# EAGLE design ardunio-physics-board-v2 (EAGLE 9.6.2)
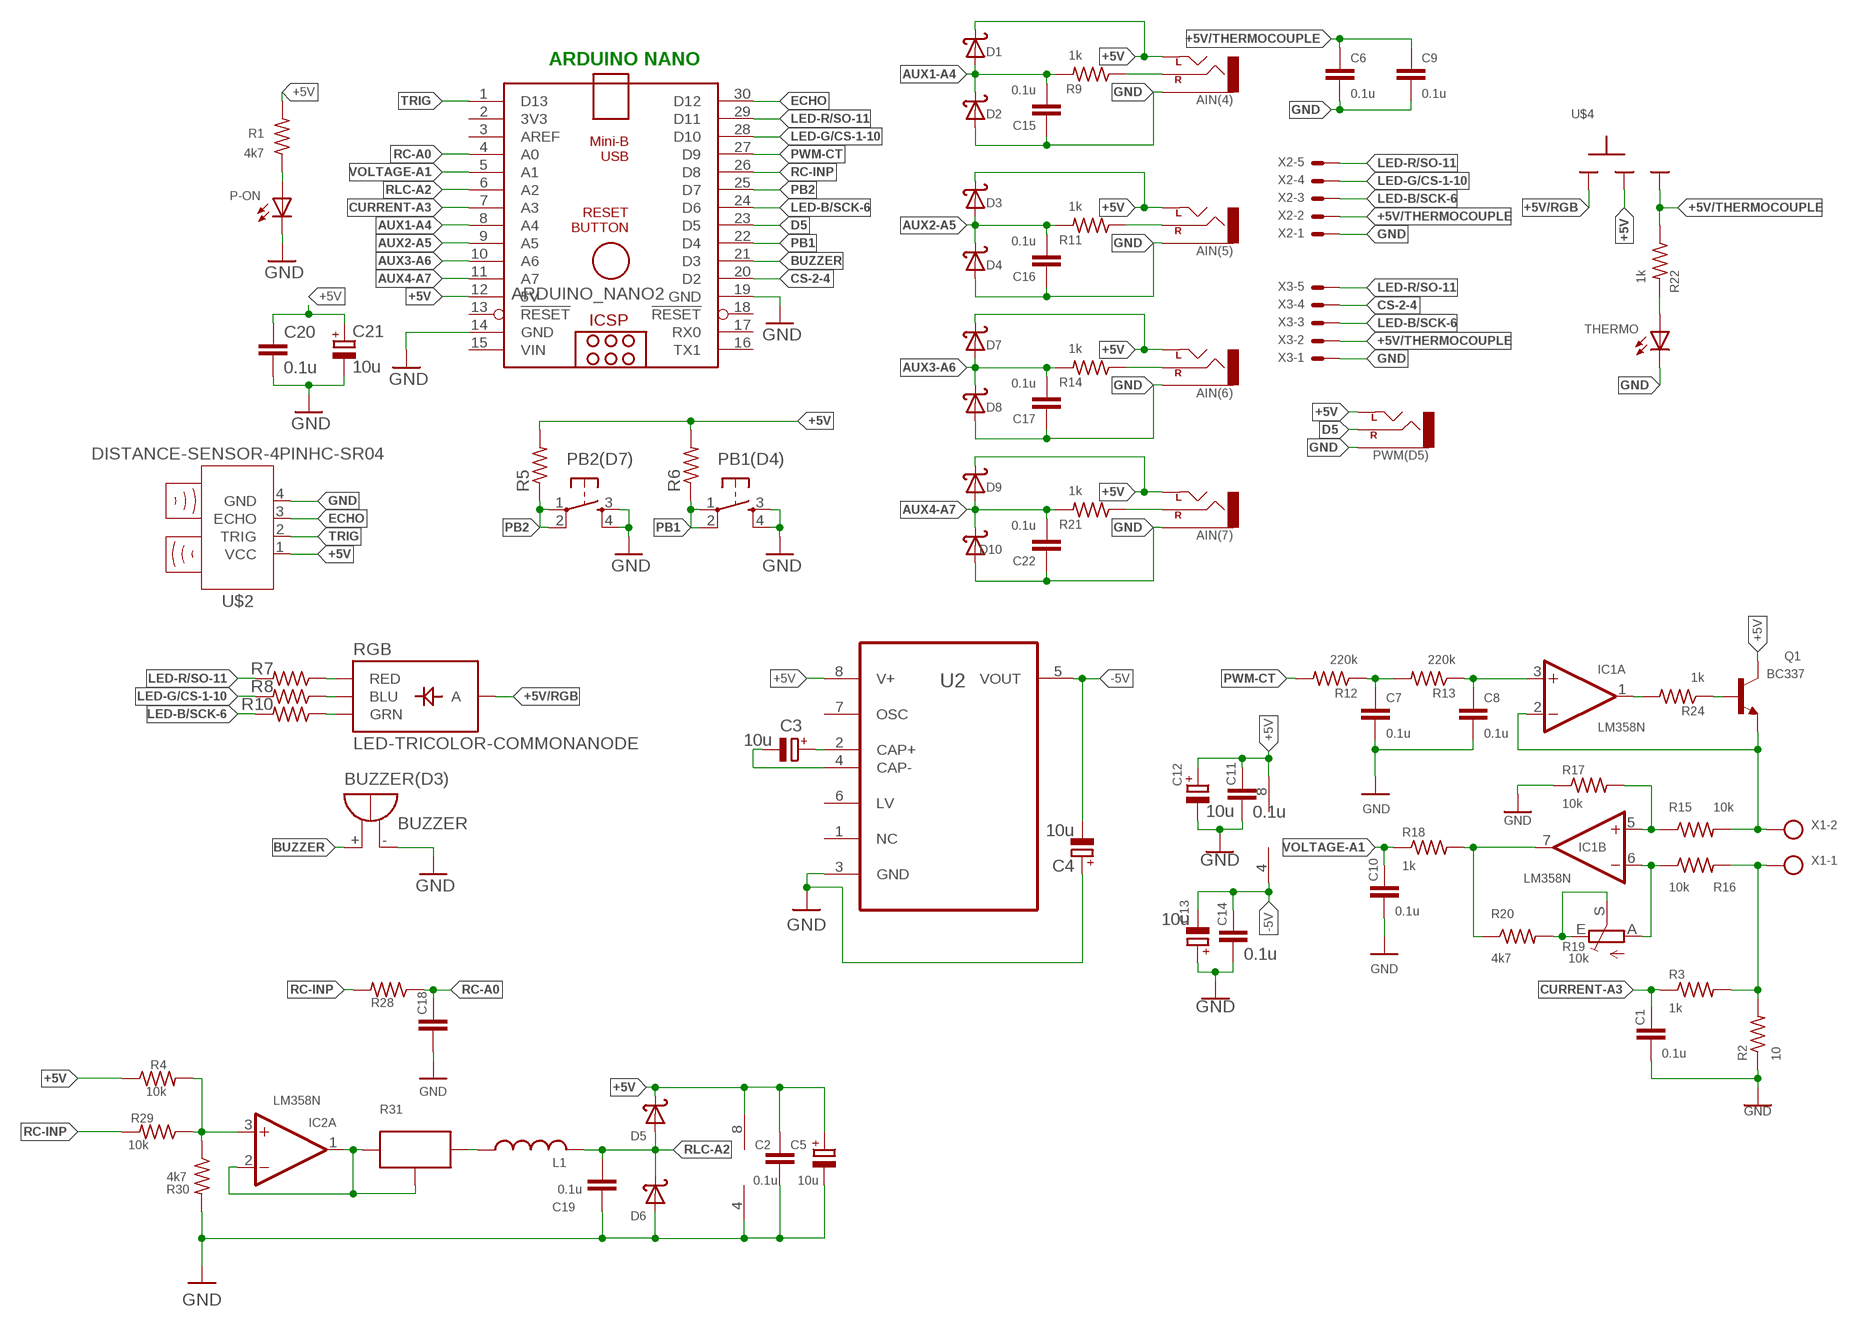
[diagram p0: schematic, sheet 1]

## Parts
AIN(4)  AUX-CONNECTOR_CEDT_JANUARY_2015_V5_AUDIO-JACKPTH  [AUX-CONNECTOR_CEDT_JANUARY_2015_V5_AUDIO-JACK]
AIN(5)  AUX-CONNECTOR_CEDT_JANUARY_2015_V5_AUDIO-JACKPTH  [AUX-CONNECTOR_CEDT_JANUARY_2015_V5_AUDIO-JACK]
AIN(6)  AUX-CONNECTOR_CEDT_JANUARY_2015_V5_AUDIO-JACKPTH  [AUX-CONNECTOR_CEDT_JANUARY_2015_V5_AUDIO-JACK]
AIN(7)  AUX-CONNECTOR_CEDT_JANUARY_2015_V5_AUDIO-JACKPTH  [AUX-CONNECTOR_CEDT_JANUARY_2015_V5_AUDIO-JACK]
ARDUINO_NANO2  ARDUINONANOV30_ARDUINO_NANO  [ARDUINONANOV30_ARDUINO_NANO]
BUZZER(D3)  BUZZER  [F/TMB]
C1  0.1u  C-EU025-025X050  [C025-025X050]
C2  0.1u  C-EU025-025X050  [C025-025X050]
C3  10u  CPOL-EUTT2D5  [TT2D5]
C4  10u  CPOL-EUTT2D5  [TT2D5]
C5  10u  CPOL-EUTT2D5  [TT2D5]
C6  0.1u  C-EU025-024X044  [C025-024X044]
C7  0.1u  C-EU025-025X050  [C025-025X050]
C8  0.1u  C-EU025-025X050  [C025-025X050]
C9  0.1u  C-EU025-024X044  [C025-024X044]
C10  0.1u  C-EU025-025X050  [C025-025X050]
C11  0.1u  C-EU025-025X050  [C025-025X050]
C12  10u  CPOL-EUTT2D5  [TT2D5]
C13  10u  CPOL-EUTT2D5  [TT2D5]
C14  0.1u  C-EU025-025X050  [C025-025X050]
C15  0.1u  C-EU025-024X044  [C025-024X044]
C16  0.1u  C-EU025-024X044  [C025-024X044]
C17  0.1u  C-EU025-024X044  [C025-024X044]
C18  C-EU025-025X050  [C025-025X050]
C19  0.1u  C-EU025-025X050  [C025-025X050]
C20  0.1u  C-EU025-024X044  [C025-024X044]
C21  10u  CPOL-EUE2.5-5  [E2,5-5]
C22  0.1u  C-EU025-024X044  [C025-024X044]
D1  1N5819  [DO41-10]
D2  1N5819  [DO41-10]
D3  1N5819  [DO41-10]
D4  1N5819  [DO41-10]
D5  1N5819  [DO41-10]
D6  1N5819  [DO41-10]
D7  1N5819  [DO41-10]
D8  1N5819  [DO41-10]
D9  1N5819  [DO41-10]
D10  1N5819  [DO41-10]
IC1  LM358N  [DIL08]
IC2  LM358N  [DIL08]
L1  L-US6000-XXX-RC  [6000-XXXX-RC]
P-ON  LED3MM  [LED3MM]
PB1(D4)  OMRON_SWITCH_40-XX  [B3F-40XX]
PB2(D7)  OMRON_SWITCH_40-XX  [B3F-40XX]
PWM(D5)  AUX-CONNECTOR_CEDT_JANUARY_2015_V5_AUDIO-JACKPTH  [AUX-CONNECTOR_CEDT_JANUARY_2015_V5_AUDIO-JACK]
Q1  BC337  [TO92]
R1  4k7  R-US_0204/7  [0204/7]
R2  10  RESISTOR0207/10  [0207/10]
R3  1k  R-US_0204/7  [0204/7]
R4  10k  R-US_0207/10  [0207/10]
R5  R-US_0204/7  [0204/7]
R6  R-US_0204/7  [0204/7]
R7  R-US_0207/10  [0207/10]
R8  R-US_0207/10  [0207/10]
R9  1k  R-US_0204/7  [0204/7]
R10  R-US_0207/10  [0207/10]
R11  1k  R-US_0204/7  [0204/7]
R12  220k  R-US_0207/10  [0207/10]
R13  220k  R-US_0204/7  [0204/7]
R14  1k  R-US_0204/7  [0204/7]
R15  10k  R-US_0204/7  [0204/7]
R16  10k  R-US_0204/7  [0204/7]
R17  10k  R-US_0204/7  [0204/7]
R18  1k  R-US_0204/7  [0204/7]
R19  10k  TRIM_EU-RJ9W  [RJ9W]
R20  4k7  R-US_0204/7  [0204/7]
R21  1k  R-US_0204/7  [0204/7]
R22  1k  R-US_0204/7  [0204/7]
R24  1k  R-US_0204/7  [0204/7]
R28  R-US_0207/10  [0207/10]
R29  10k  R-US_0204/7  [0204/7]
R30  4k7  R-US_0207/10  [0207/10]
R31  POTNORMAL  [RJ9W]
RGB  LED-TRICOLOR-COMMONANODE  [LED-TRICOLOR-THROUGHHOLE]
THERMO  LED3MM  [LED3MM]
U2  ICL7660CPAZ_ICL7660CPAZ  [ICL7660CPAZ_DIP254P762X533-8]
U$2  DISTANCE-SENSOR-4PINHC-SR04  [HC-SR04]
U$4  SLIDESWITCH-BIG  [BIGSWITCH]
X1  AK500/2-H  [AK500/2-H]
X2  JST-XH-05-PIN-LONG-PAD  [JST-XH-05-PACKAGE-LONG-PAD]
X3  JST-XH-05-PIN-LONG-PAD  [JST-XH-05-PACKAGE-LONG-PAD]

## Nets
+5V [POWER]: AIN(4).TIP(LEFT) AIN(5).TIP(LEFT) AIN(6).TIP(LEFT) AIN(7).TIP(LEFT) ARDUINO_NANO2.12(5V) C2.1 C5.+ C11.1 C12.+ C20.1 C21.+ D1.C D3.C D5.C D7.C D9.C IC1.8(P:V+) IC2.8(P:V+) PWM(D5).TIP(LEFT) Q1.3(C) R1.2 R4.1 R5.2 R6.2 U2.8(V+) U$2.1(VCC) U$4.2
+5V/RGB: RGB.ANODE(A) U$4.1
+5V/THERMOCOUPLE: C6.1 C9.1 R22.1 U$4.3 X2.2 X3.2
-5V: C4.- C13.- C14.1 IC1.4(P:V-) U2.5(VOUT)
AUX1-A4: ARDUINO_NANO2.8(A4) C15.2 D1.A D2.C R9.2
AUX2-A5: ARDUINO_NANO2.9(A5) C16.2 D3.A D4.C R11.2
AUX3-A6: ARDUINO_NANO2.10(A6) C17.2 D7.A D8.C R14.2
AUX4-A7: ARDUINO_NANO2.11(A7) C22.2 D9.A D10.C R21.2
BUZZER: ARDUINO_NANO2.21(D3) BUZZER(D3).+
CS-2-4: ARDUINO_NANO2.20(D2) X3.4
CURRENT-A3: ARDUINO_NANO2.7(A3) C1.1 R3.1
D5: ARDUINO_NANO2.23(D5) PWM(D5).RING(RIGHT)
ECHO: ARDUINO_NANO2.30(D12) U$2.3(ECHO)
GND [POWER]: AIN(4).SLEEVE AIN(5).SLEEVE AIN(6).SLEEVE AIN(7).SLEEVE ARDUINO_NANO2.14(GND) ARDUINO_NANO2.19(GND) BUZZER(D3).- C1.2 C2.2 C4.+ C5.- C6.2 C7.2 C8.2 C9.2 C10.2 C11.2 C12.- C13.+ C14.2 C15.1 C16.1 C17.1 C18.2 C19.2 C20.2 C21.- C22.1 D2.A D4.A D6.A D8.A D10.A IC2.4(P:V-) P-ON.K(C) PB1(D4).3(S) PB1(D4).4(S1) PB2(D7).3(S) PB2(D7).4(S1) PWM(D5).SLEEVE R2.1 R17.1 R30.2 THERMO.K(C) U2.3(GND) U$2.4(GND) X2.1 X3.1
LED-B/SCK-6: ARDUINO_NANO2.24(D6) R10.2 X2.3 X3.3
LED-G/CS-1-10: ARDUINO_NANO2.28(D10) R8.2 X2.4
LED-R/SO-11: ARDUINO_NANO2.29(D11) R7.2 X2.5 X3.5
N$1: IC1.2(A:-IN) Q1.1(E) R15.2 X1.2
N$2: R7.1 RGB.RED
N$3: R8.1 RGB.BLU
N$4: R10.1 RGB.GRN
N$5: IC1.1(A:OUT) R24.2
N$6: C8.1 IC1.3(A:+IN) R13.1
N$7: IC2.3(A:+IN) R4.2 R29.1 R30.1
N$9: C3.+ U2.2(CAP+)
N$10: C3.- U2.4(CAP-)
N$11: C7.1 R12.1 R13.2
N$12: R2.2 R3.2 R16.2 X1.1
N$13: P-ON.A R1.1
N$14: Q1.2(B) R24.1
N$15: IC2.1(A:OUT) IC2.2(A:-IN) R31.E R31.S
N$16: AIN(4).RING(RIGHT) R9.1
N$17: IC1.5(B:+IN) R15.1 R17.2
N$18: IC1.6(B:-IN) R16.1 R19.A
N$20: R19.E R19.S R20.2
N$21: IC1.7(B:OUT) R18.2 R20.1
N$22: AIN(5).RING(RIGHT) R11.1
N$25: L1.1 R31.A
N$27: R22.2 THERMO.A
N$29: AIN(6).RING(RIGHT) R14.1
N$31: AIN(7).RING(RIGHT) R21.1
PB1: ARDUINO_NANO2.22(D4) PB1(D4).1(P) PB1(D4).2(P1) R6.1
PB2: ARDUINO_NANO2.25(D7) PB2(D7).1(P) PB2(D7).2(P1) R5.1
PWM-CT: ARDUINO_NANO2.27(D9) R12.2
RC-A0: ARDUINO_NANO2.4(A0) C18.1 R28.1
RC-INP: ARDUINO_NANO2.26(D8) R28.2 R29.2
RLC-A2: ARDUINO_NANO2.6(A2) C19.1 D5.A D6.C L1.2
TRIG: ARDUINO_NANO2.1(D13) U$2.2(TRIG)
VOLTAGE-A1: ARDUINO_NANO2.5(A1) C10.1 R18.1
Unconnected: ARDUINO_NANO2.2(3V3) ARDUINO_NANO2.3(AREF) ARDUINO_NANO2.13(!RESET) ARDUINO_NANO2.16(TX1) ARDUINO_NANO2.17(RX0) ARDUINO_NANO2.18(!RESET) IC2.5(B:+IN) IC2.6(B:-IN) IC2.7(B:OUT) U2.1(NC) U2.6(LV) U2.7(OSC)

## Notes on the sheet
- ARDUINO NANO

## Power pins joined to a net without a drawn wire
VIN: ARDUINO_NANO2.15(VIN)

## Library data of the parts
AIN(4) AIN(5) AIN(6) AIN(7) PWM(D5) = aux-connector:AUX-CONNECTOR_CEDT_JANUARY_2015_V5_AUDIO-JACK: 3.5mm Audio Jack Simple 3.5mm common PCB mount audio jack. SKU: PRT-08032
ARDUINO_NANO2 = nano:ARDUINONANOV30_ARDUINO_NANO: Arduino Nano V3.0 Overview: The Arduino Nano is a small, complete, and breadboard-friendly board based on the ATmega328 (Arduino Nano 3.x) or ATmega168 (Arduino Nano 2.x). It has more or less the same functionality of the Arduino Duemilanove, but in a different package. It lacks only a DC power jack, and works with a Mini-B USB cable instead of a standard one. The Nano was designed and is being produced by Gravitech. Specifications: Microcontroller Atmel ATmega168 or ATmega328 Operating Voltage (logic level) 5 V Input Voltage (recommended) 7-12 V Input Voltage (limits) 6-20 V Digital I/O Pins 14 (of which 6 provide PWM output) Analog Input Pins 8 DC Current per I/O Pin 40 mA Flash Memory 16 KB (ATmega168) or 32 KB (ATmega328) of which 2 KB used by bootloader SRAM 1 KB (ATmega168) or 2 KB (ATmega328) EEPROM 512 bytes (ATmega168) or 1 KB (ATmega328) Clock Speed 16 MHz Dimensions 0.73" x 1.70" Length 45 mm Width 18 mm Weigth 5 g Power: The Arduino Nano can be powered via the Mini-B USB connection, 6-20V unregulated external power supply (pin 30), or 5V regulated external power supply (pin 27). The power source is automatically selected to the highest voltage source. Memory: The ATmega168 has 16 KB of flash memory for storing code (of which 2 KB is used for the bootloader); the ATmega328 has 32 KB, (also with 2 KB used for the bootloader). The ATmega168 has 1 KB of SRAM and 512 bytes of EEPROM (which can be read and written with the EEPROM library); the ATmega328 has 2 KB of SRAM and 1 KB of EEPROM. Input and Output: Each of the 14 digital pins on the Nano can be used as an input or output, using pinMode(), digitalWrite(), and digitalRead() functions. They operate at 5 volts. Each pin can provide or receive a maximum of 40 mA and has an internal pull-up resistor (disconnected by default) of 20-50 kOhms. In addition, some pins have specialized functions. Visit Arduino - ArduinoBoardNano <https://www.arduino.cc/en/Main/ArduinoBoardNano>
BUZZER(D3) = CEDT_JANUARY_2015_v5:BUZZER: BUZZER Source: Buerklin; OC_FARNELL: unknown; OC_NEWARK: unknown
C1 C2 C6-C11 C14-C20 C22 = rcl:C-EU: CAPACITOR, European symbol; SPICEPREFIX: C
C3-C5 C12 C13 C21 = rcl:CPOL-EU: POLARIZED CAPACITOR, European symbol; SPICEPREFIX: C
D1-D10 = CEDT_JANUARY_2015_v5:1N5819: DIODE general purpose rectifier, 1 A
IC1 IC2 = CEDT_JANUARY_2015_v5:LM358: OP AMP also LM158; LM258; LM2904 Source: http://cache.national.com/ds/LM/LM158.pdf
L1 = rcl:L-US: INDUCTOR, American symbol; SPICEPREFIX: L
P-ON THERMO = CEDT:LED; OC_FARNELL: unknown
PB1(D4) PB2(D7) = CEDT_JANUARY_2015_v5:OMRON_SWITCH
Q1 = transistor-npn:BC337*: NPN Transistor
R1 R3-R18 R20-R22 R24 R28-R30 = rcl:R-US_: RESISTOR, American symbol; SPICEPREFIX: R
R2 = CEDT_JANUARY_2015_v5:RESISTOR
R19 = pot:TRIM_EU-: POTENTIOMETER
R31 = CEDT_JANUARY_2015_v5:POT
RGB = CEDT_JANUARY_2015_v5:LED-TRICOLOR-COMMONANODE
U2 = CurveTracer_V6:ICL7660CPAZ_ICL7660CPAZ: CMOS Voltage Converters Check prices <https://pricing.snapeda.com/parts/ICL7660CPAZ/Renesas%20Electronics/view-part?ref=eda>; AVAILABILITY: In Stock; DESCRIPTION: Charge Pump Switching Regulator IC Positive or Negative Fixed -Vin, 2Vin 1 Output 45mA 8-DIP (0.300, 7.62mm); MF: Renesas Electronics; MP: ICL7660CPAZ; PACKAGE: DIP-8 Intersil; PRICE: None
U$2 = Tinkercad:DISTANCE-SENSOR-4PIN
U$4 = CEDT_JANUARY_2015_v5:SLIDESWITCH
X1 = con-ptr500:AK500/2-H: CONNECTOR Aug. 2004 / PTR Meßtechnik: Die Bezeichnung der Serie AK505 wurde geändert. Es handelt sich hierbei um AK500 in horizontaler Ausführung.; OC_FARNELL: unknown; OC_NEWARK: unknown
X2 X3 = Rembrandt Electronics - JST XH Connectors v1-0:JST-XH-05-PIN: JST XH Connector 2 Pin Wire to board connector. Pitch: 2,54 mm, (0.100") Number of pins: 5 Created by Rembrandt Electronics www.rembrandtelectronics.com

## Net classes
0 default: width 0.813 mm
1 POWER: width 1.016 mm

## Board
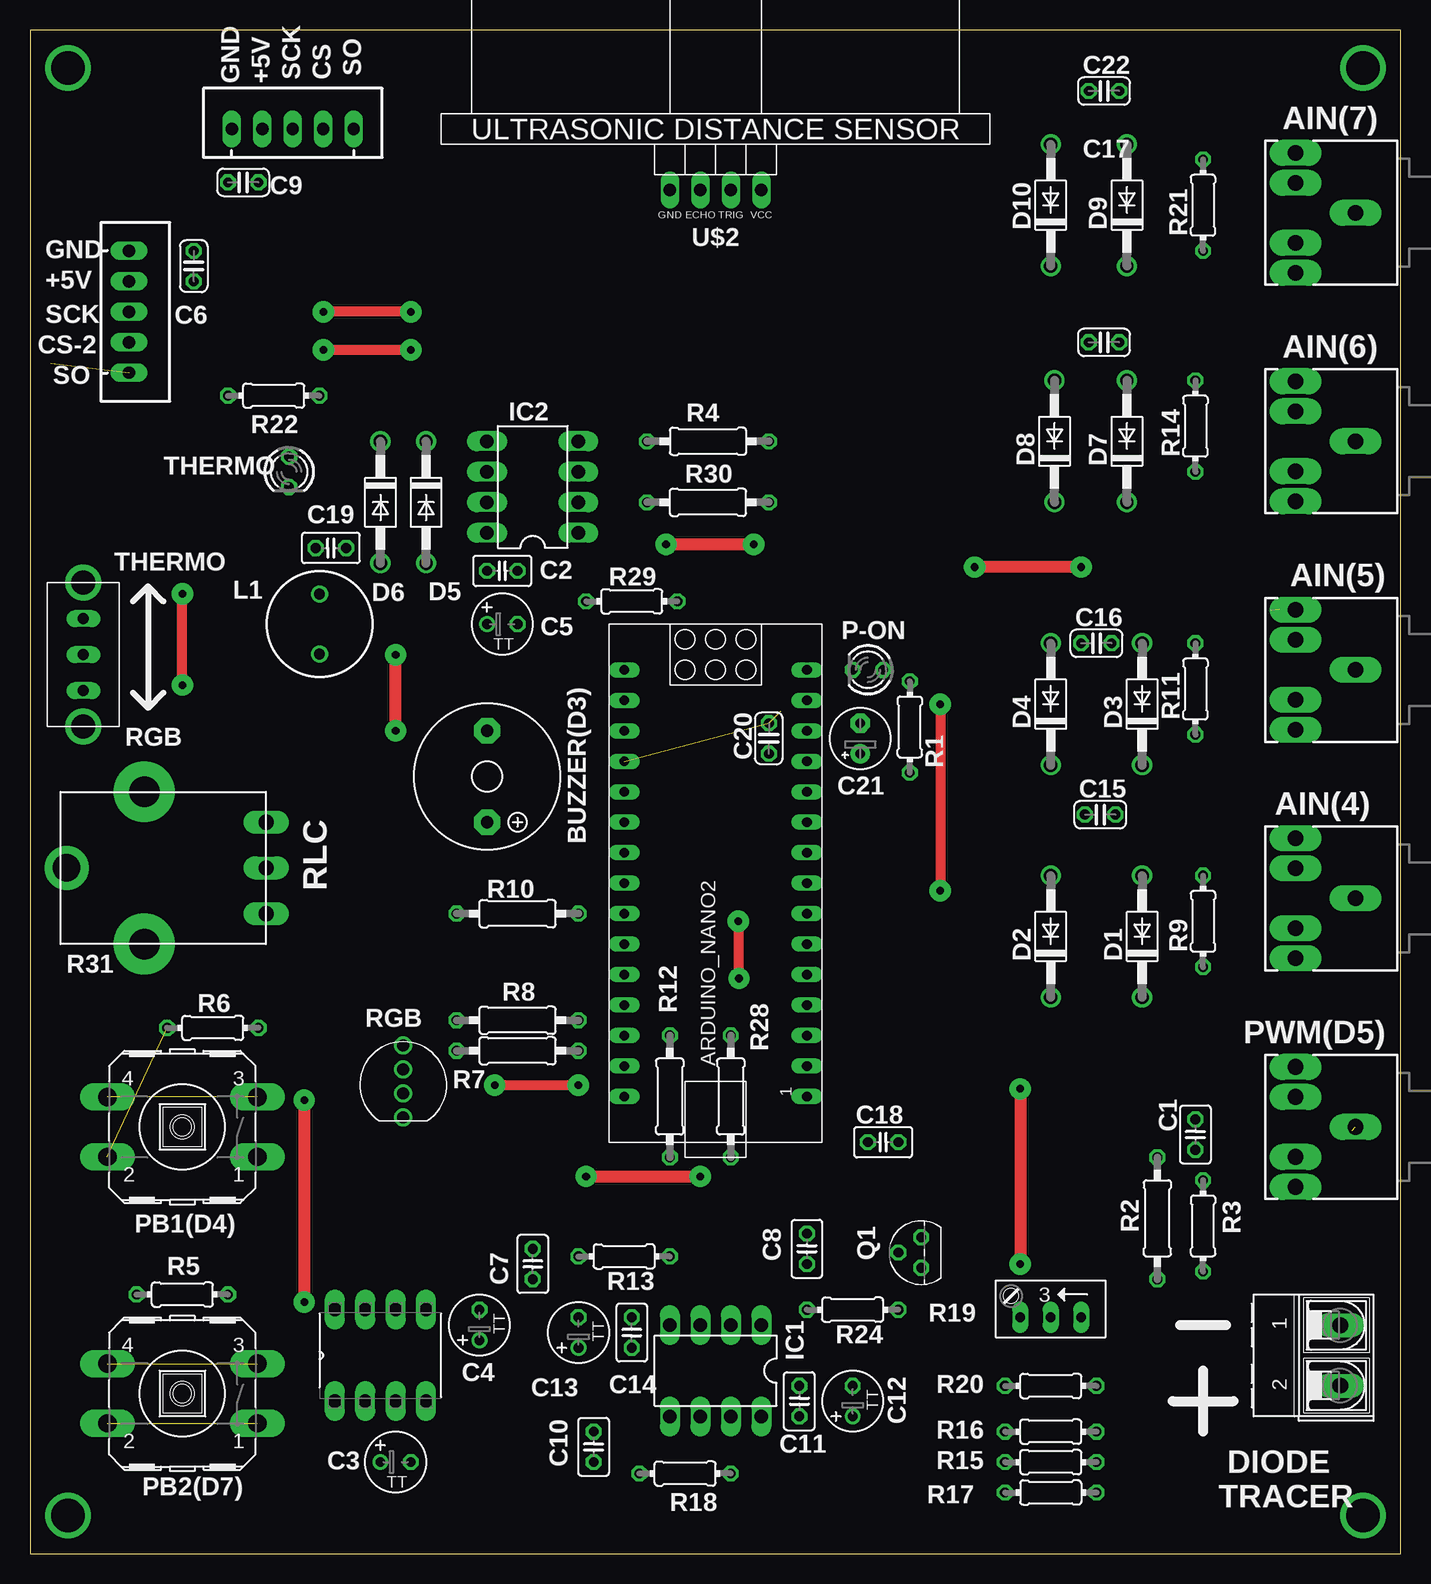
[diagram p1: board, top side]
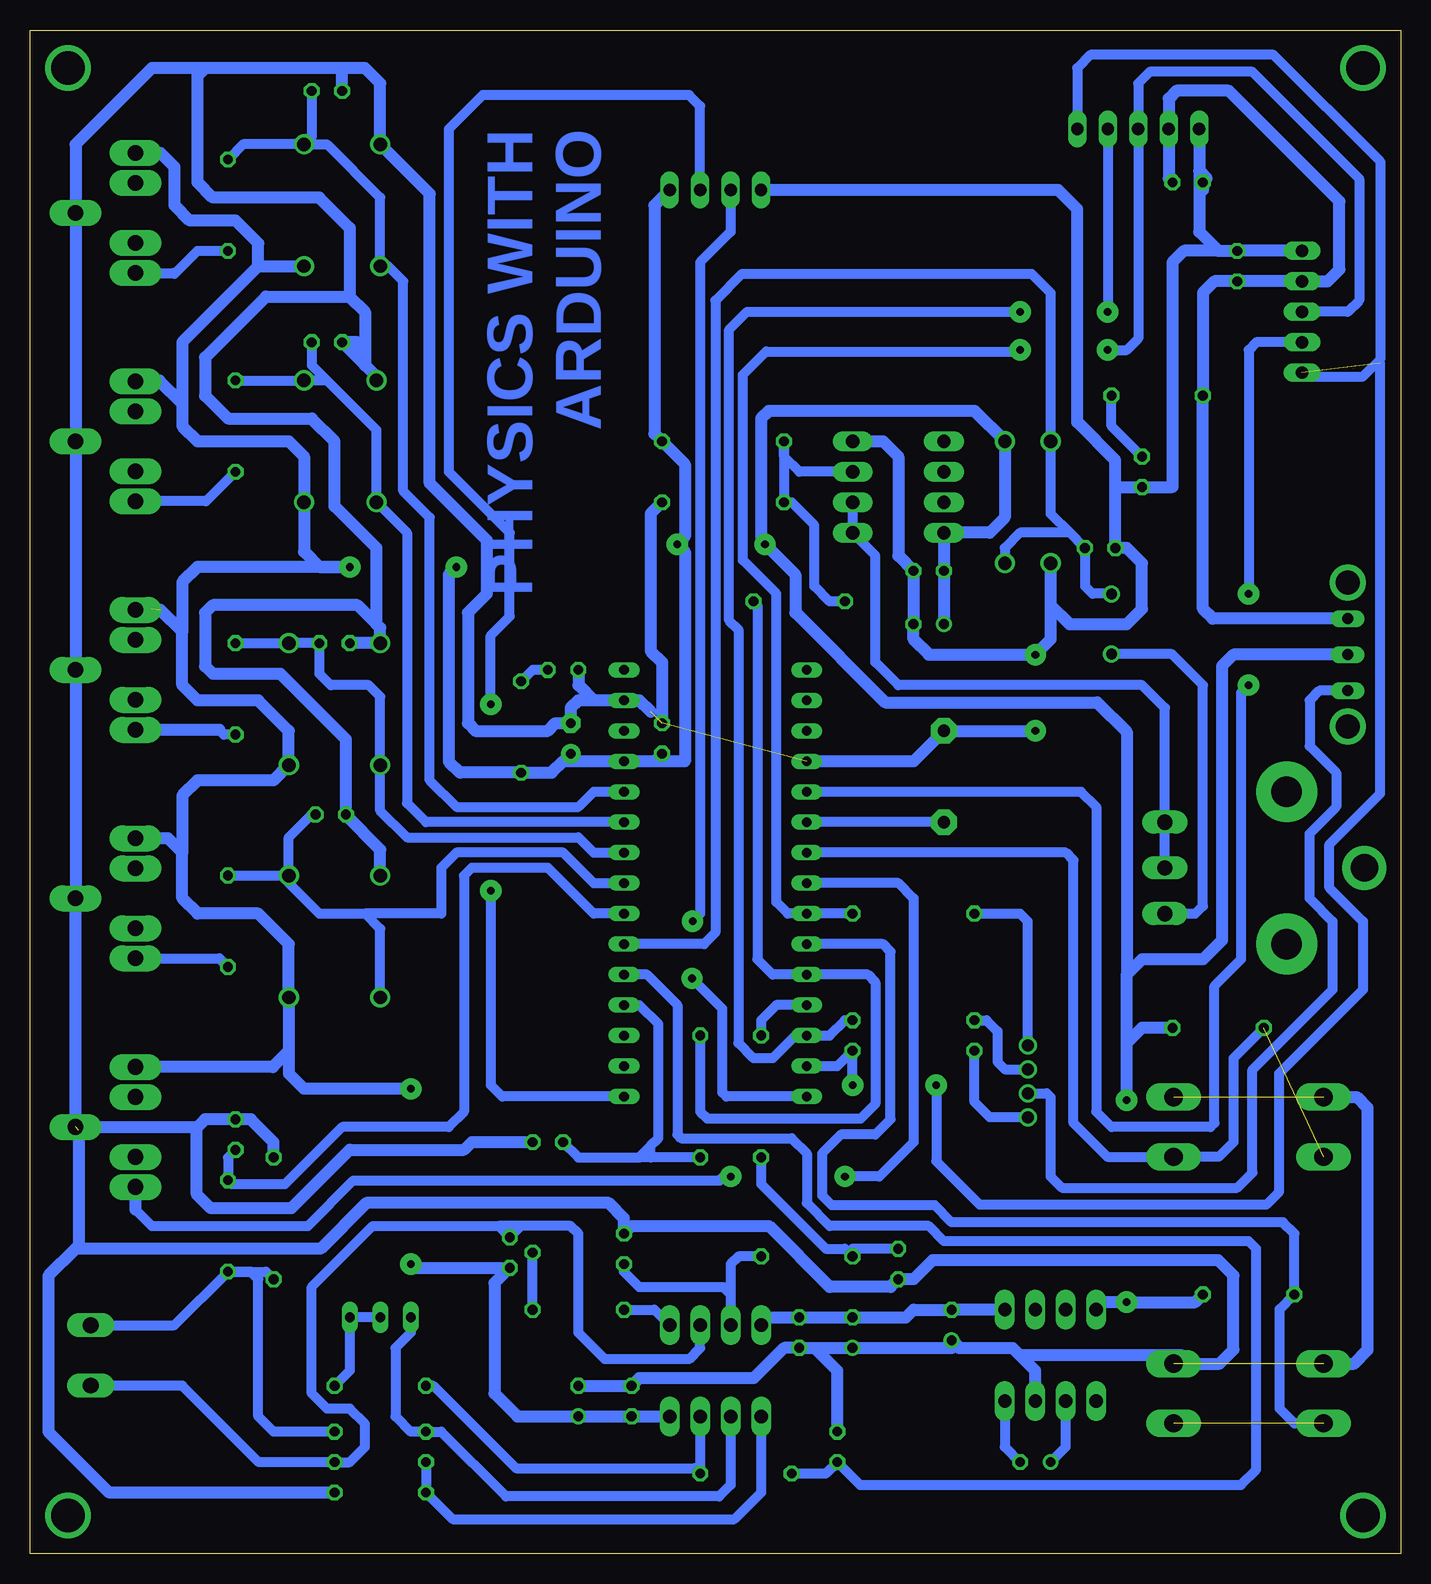
[diagram p2: board, bottom side, seen from below]

Size 114.29 x 127 mm. Coordinates in mm from the lower left corner, seen from the top.
Outline: 0,0 114.28,0 114.29,127 0.01,127 0,0
Copper layers (1*16): Top 0.035mm / dielectric 1.5mm / Bottom 0.035mm
Design rules "default *": minimum track width 6mil, minimum drill 0.35mm, track to track 12mil, track to pad 12mil, pad to pad 12mil, via to via 12mil, smd to smd 12mil, copper to edge 40mil, drill to drill 6mil, minimum pad ring 10mil, minimum via ring 8mil, stop-mask expansion 4mil, vias tented up to drill 0mil, thermal gap 10mil

### Footprints (pad centres in the part's own frame; a part is rotated, then mirrored left to right if it is on the bottom)
AUX-CONNECTOR_CEDT_JANUARY_2015_V5_AUDIO-JACK = drill 1.3 pad 2.184 long: RING 5,5; RSH 5,2.5; SLEEVE 0,0; TIP 5,-5; TSH 5,-2.5
ARDUINONANOV30_ARDUINO_NANO = drill 0.8 long: 1 16.51,3.81; 2 16.51,6.35; 3 16.51,8.89; 4 16.51,11.43; 5 16.51,13.97; 6 16.51,16.51; 7 16.51,19.05; 8 16.51,21.59; 9 16.51,24.13; 10 16.51,26.67; 11 16.51,29.21; 12 16.51,31.75; 13 16.51,34.29; 14 16.51,36.83; 15 16.51,39.37; 16 1.27,39.37; 17 1.27,36.83; 18 1.27,34.29; 19 1.27,31.75; 20 1.27,29.21; 21 1.27,26.67; 22 1.27,24.13; 23 1.27,21.59; 24 1.27,19.05; 25 1.27,16.51; 26 1.27,13.97; 27 1.27,11.43; 28 1.27,8.89; 29 1.27,6.35; 30 1.27,3.81
F/TMB = drill 1.016 pad 2.159 octagon: + 3.81,0; - -3.81,0
C025-025X050 = drill 0.813 octagon: 1 -1.27,0; 2 1.27,0
TT2D5 = drill 0.813: + -1.27,0 | drill 0.813 octagon: - 1.27,0
C025-024X044 = drill 0.813 octagon: 1 -1.27,0; 2 1.27,0
E2,5-5 = drill 0.813 pad 1.6: + -1.27,0 | drill 0.813 pad 1.6 octagon: - 1.27,0
DO41-10 = drill 1.118: A 5.08,0; C -5.08,0
DIL08 = drill 1.118 long: 1 -3.81,-3.81; 2 -1.27,-3.81; 3 1.27,-3.81; 4 3.81,-3.81; 5 3.81,3.81; 6 1.27,3.81; 7 -1.27,3.81; 8 -3.81,3.81
6000-XXXX-RC = drill 0.9 pad 1.422: 1 -2.5,0; 2 2.5,0
LED3MM = drill 0.813 octagon: A -1.27,0; K 1.27,0
B3F-40XX = drill 1.524 long: 1 -6.248,2.489; 2 6.248,2.489; 3 -6.248,-2.489; 4 6.248,-2.489
TO92 = drill 0.813 octagon: 1 1.27,0; 2 0,1.905; 3 -1.27,0
0204/7 = drill 0.813 octagon: 1 -3.81,0; 2 3.81,0
0207/10 = drill 0.813 octagon: 1 -5.08,0; 2 5.08,0
RJ9W = drill 0.813 long: A 2.54,0.635; E -2.54,0.635; S 0,0.635
RJ9W' = drill 1.27 long: A 3.81,8.255; E -3.81,8.255; S 0,8.255 | drill 2.286 pad 3.658: P$1 0,-8.382 | drill 2.54 pad 5.08: P$3 6.35,-1.905; P$4 -6.35,-1.905
LED-TRICOLOR-THROUGHHOLE = drill 1: ANODE -1,0; BLU 1,0; GRN 3,0; RED -3,0
ICL7660CPAZ_DIP254P762X533-8 = drill 1.118 long: 1 -7.62,7.62; 2 -7.62,5.08; 3 -7.62,2.54; 4 -7.62,0; 5 0,0; 6 0,2.54; 7 0,5.08; 8 0,7.62
HC-SR04 = drill 1.016 long: 1 -3.81,0; 2 -1.27,0; 3 1.27,0; 4 3.81,0
BIGSWITCH = drill 0.9 long: 1 -3,0; 2 0,0; 3 3,0 | drill 2 pad 2.184: TAB1 -6,0; TAB2 6,0
AK500/2-H = drill 1.321 long: 1 -2.515,0; 2 2.515,0
JST-XH-05-PACKAGE-LONG-PAD = drill 1.016 long: 1 -5.08,0; 2 -2.54,0; 3 0,0; 4 2.54,0; 5 5.08,0

### Placement (x,y rotation side)
AIN(4)  110.49,54.61 180 top
AIN(5)  110.49,73.66 180 top
AIN(6)  110.49,92.71 180 top
AIN(7)  110.49,111.76 180 top
ARDUINO_NANO2  48.26,34.29 0 top
BUZZER(D3)  38.1,64.77 270 top
C1  97.16,34.92 90 top
C2  39.37,81.92 0 top
C3  30.48,7.62 0 top
C4  37.47,19.05 90 top
C5  39.37,77.47 0 top
C6  13.65,107.31 90 top
C7  41.91,24.13 270 top
C8  64.77,25.4 90 top
C9  17.78,114.3 180 top
C10  46.99,8.89 90 top
C11  64.14,12.7 90 top
C12  68.58,12.7 90 top
C13  45.72,18.41 90 top
C14  50.16,18.41 270 top
C15  89.22,61.59 0 top
C16  88.9,75.88 0 top
C17  89.53,100.97 0 top
C18  71.12,34.29 0 top
C19  25.08,83.82 180 top
C20  61.59,67.94 90 top
C21  69.22,67.94 90 top
C22  89.53,121.92 0 top
D1  92.71,51.44 90 top
D2  85.09,51.44 90 top
D3  92.71,70.8 90 top
D4  85.09,70.8 90 top
D5  33.02,87.63 270 top
D6  29.21,87.63 270 top
D7  91.44,92.71 90 top
D8  85.41,92.71 90 top
D9  91.44,112.39 90 top
D10  85.09,112.39 90 top
IC1  57.15,15.24 180 top
IC2  41.91,88.9 90 top
L1  24.13,77.47 90 top
P-ON  69.85,73.66 180 top
PB1(D4)  12.7,35.56 180 top
PB2(D7)  12.7,13.34 180 top
PWM(D5)  110.49,35.56 180 top
Q1  74.3,25.08 90 top
R1  73.34,68.9 270 top
R2  93.98,27.94 270 top
R3  97.79,27.3 270 top
R4  56.52,92.71 180 top
R5  12.7,21.59 0 top
R6  15.24,43.81 0 top
R7  40.64,41.91 0 top
R8  40.64,44.45 0 top
R9  97.79,52.7 90 top
R10  40.64,53.34 0 top
R11  97.16,72.07 90 top
R12  53.34,38.1 90 top
R13  49.53,24.77 180 top
R14  97.16,93.98 90 top
R15  85.09,7.62 0 top
R16  85.09,10.16 0 top
R17  85.09,5.08 180 top
R18  54.61,6.67 0 top
R19  85.09,20.32 180 top
R20  85.09,13.97 0 top
R21  97.79,112.39 90 top
R22  20.32,96.52 0 top
R24  68.58,20.32 180 top
R28  58.42,38.1 90 top
R29  50.16,79.38 0 top
R30  56.52,87.63 0 top
R31  [RJ9W']  11.43,57.15 270 top
RGB  31.11,39.37 90 top
THERMO  21.59,90.17 270 top
U2  33.02,20.32 90 top
U$2  57.15,113.67 180 top
U$4  4.45,74.93 90 top
X1  109.22,16.51 270 top
X2  21.91,118.75 0 top
X3  8.26,103.5 270 top

### Tracks (layer width: path | path; a pad name or v marks a point on that pad's centre or on a via)
+5V  (via drill 0.64 pad 1.78)  (1 unrouted)
  Top 1.016: v82.55,38.73 v82.55,24.13 | v87.63,82.23 v78.74,82.23 | v22.86,37.78 v22.86,20.95 | v53.02,84.14 v60.33,84.14
  Bottom 1.016: 95.25,107.31 D9.C | D1.C 92.71,41.91 94.06,40.56 PWM(D5).TIP | C20.1 62.23,66.04 | IC1.8 C11.1 C12.+ 73.66,11.43 75.56,13.34 75.56,22.54 Q1.3 82.23,23.81 v82.55,24.13 | 62.23,66.04 59.69,66.04 59.69,83.5 v60.33,84.14 59.69,84.77 59.69,90.81 R4.1 62.23,93.34 62.23,112.39 U$2.1 | C5.+ C2.1 IC2.8 34.29,85.09 33.02,86.36 D5.C 35.56,95.25 52.7,95.25 53.34,94.61 53.34,84.45 v53.02,84.14 50.48,81.6 50.48,78.42 43.02,70.95 25.31,70.95 22.86,68.5 22.86,48.26 | C21.+ 69.85,66.04 | 69.85,66.04 70.8,65.09 R1.2 78.42,65.09 79.38,66.04 79.38,81.6 v78.74,82.23 | R5.2 17.14,20.95 v22.86,20.95 24.77,20.95 U2.8 | D1.C 92.71,40.01 91.44,38.73 v82.55,38.73 | R6.2 21.59,43.81 22.86,42.55 | v22.86,37.78 22.86,42.55 | U$4.2 13.97,74.93 14.92,73.98 14.92,51.12 16.51,49.53 21.59,49.53 22.86,48.26 | 22.86,42.55 22.86,48.26 | 101.6,95.89 101.6,93.98 100.33,92.71 92.71,92.71 91.44,91.44 D7.C 91.44,83.5 90.17,82.23 v87.63,82.23 100.33,82.23 101.6,80.96 101.6,76.83 | 95.25,107.31 95.25,109.22 97.16,111.12 100.97,111.12 102.23,112.39 102.23,115.57 103.42,116.76 AIN(7).TIP | 101.6,76.83 101.6,72.39 100.33,71.12 95.25,71.12 92.71,68.58 D3.C 93.98,64.45 100.33,64.45 101.6,63.18 101.6,58.42 | 101.6,76.83 103.42,78.66 | D1.C 92.71,50.8 95.25,53.34 100.33,53.34 101.6,54.61 101.6,58.42 | 101.6,58.42 102.79,59.61 AIN(4).TIP | AIN(5).TIP 105.41,78.74 104.14,78.74 | AIN(6).TIP 105.41,97.79 103.5,97.79 101.6,95.89 | 101.6,95.89 101.6,100.97 95.25,107.31 | 62.23,66.04 ARDUINO_NANO2.12 69.85,66.04
+5V/RGB
  Bottom 0.813: RGB.ANODE 29.53,38.37 29.21,38.05 29.21,31.43 28.26,30.48 13.65,30.48 12.38,31.75 12.38,40.32 5.71,46.99 5.71,52.7 7.62,54.61 7.62,60.01 5.4,62.23 5.4,65.09 7.62,67.31 7.62,71.12 6.81,71.93 U$4.1
+5V/THERMOCOUPLE
  Bottom 1.016: U$4.3 15.7,77.93 16.51,78.74 R22.1 16.51,105.09 15.56,106.05 C6.1 X3.2 6.12,106.05 5.13,107.03 5.13,112.71 14.34,121.92 18.73,121.92 19.37,121.28 X2.2 19.37,114.62 C9.1
-5V
  Bottom 1.016: IC1.4 52.7,19.68 C14.1 C13.- 41.27,19.68 40.64,20.32 C4.- U2.5
AUX1-A4
  Bottom 0.813: D1.A 92.71,59.69 90.81,61.59 C15.2 | 86.36,53.34 90.17,53.34 92.71,55.88 D1.A | R9.2 D1.A | 86.36,53.34 80.01,53.34 80.01,57.15 78.74,58.42 69.85,58.42 67.31,55.88 ARDUINO_NANO2.8 | D2.C 85.09,52.07 86.36,53.34
AUX2-A5
  Bottom 0.813: R11.2 D3.A C16.2 90.17,73.34 89.22,72.39 86.04,72.39 85.09,71.44 D4.C 85.09,61.91 82.87,59.69 68.58,59.69 67.31,58.42 ARDUINO_NANO2.9
AUX3-A6
  Bottom 0.813: R14.2 D7.A 89.53,97.79 | C17.2 90.81,99.06 89.53,97.79 | 89.53,97.79 85.41,93.66 D8.C 82.87,85.09 82.87,62.55 81.28,60.96 ARDUINO_NANO2.10
AUX4-A7
  Bottom 0.813: D9.A 89.53,117.47 85.09,113.03 D10.C 84.45,107.31 83.19,106.05 83.19,88.58 80.96,86.36 80.96,64.45 78.74,62.23 68.58,62.23 67.31,63.5 ARDUINO_NANO2.11 | C22.2 90.81,118.11 D9.A | D9.A 96.52,117.47 R21.2
BUZZER
  Bottom 0.813: BUZZER(D3).+ ARDUINO_NANO2.21
CS-2-4  (via drill 0.64 pad 1.78)
  Top 0.813: v12.7,72.39 v12.7,80.01
  Bottom 0.813: v12.7,72.39 13.34,71.75 13.34,49.53 15.56,47.31 15.56,35.88 15.88,35.56 24.13,35.56 25.4,36.83 25.4,62.23 26.67,63.5 ARDUINO_NANO2.20 | v12.7,80.01 12.7,100.33 12.06,100.97 X3.4
CURRENT-A3
  Bottom 0.813: C1.1 97.79,33.02 R3.1 97.47,30.8 93.03,30.8 88.27,35.56 79.38,35.56 78.11,36.83 78.11,56.52 77.47,57.15 71.12,57.15 67.31,53.34 ARDUINO_NANO2.7
D5  (via drill 0.64 pad 1.78)
  Top 1.016: v46.35,31.43 v55.88,31.43
  Bottom 0.813: v46.35,31.43 43.5,31.43 40.64,34.29 40.64,54.61 41.91,55.88 ARDUINO_NANO2.23 | v55.88,31.43 56.45,31.43 56.8,31.08 87.34,31.08 91.12,27.3 104.14,27.3 105.49,28.66
  Bottom 1.016: 105.49,28.66 PWM(D5).RING
ECHO  (via drill 0.64 pad 1.78)
  Top 0.813: v59.11,47.94 59.11,52.65 v59.05,52.7
  Bottom 0.813: U$2.3 55.88,110.17 58.42,107.63 58.42,53.34 v59.05,52.7 | v59.11,47.94 56.57,45.4 56.57,38.42 56.25,38.1 ARDUINO_NANO2.30
GND  (via drill 0.64 pad 1.78)  (5 unrouted)
  Top 1.016: v30.48,68.58 v30.48,74.93
  Bottom 1.016: 88.27,123.83 86.36,123.83 85.09,122.56 D10.A 80.96,113.35 80.96,89.22 76.2,84.45 76.2,80.01 77.79,78.42 77.79,69.22 77.15,68.58 71.12,68.58 70.48,69.22 C21.- 69.22,70.48 68.58,71.12 67.31,71.12 | 86.36,99.06 85.41,98.11 D8.A | 62.55,70.17 63.5,71.12 ARDUINO_NANO2.14 67.31,71.12 | 87.63,104.78 87.63,110.49 90.17,113.03 99.06,113.03 100.33,114.3 100.33,123.19 99.69,123.83 | 87,100.97 86.36,100.97 | 87.63,104.78 94.61,104.78 99.69,99.69 99.69,96.52 97.79,94.61 90.81,94.61 88.9,92.71 88.9,87.31 85.41,83.82 85.41,77.47 | 87.63,104.78 86.36,103.5 86.36,100.97 | 86.36,100.97 86.36,100.33 | 86.36,100.33 86.36,99.06 | C12.- C11.2 63.5,14.61 53.98,14.61 51.44,17.14 C14.2 48.9,17.14 | 48.9,17.14 C13.+ 37.47,17.14 C4.+ 36.83,17.14 32.38,17.14 31.75,16.51 | U2.3 30.48,15.24 31.75,16.51 | R17.1 107.68,5.08 112.76,10.16 112.76,23.13 110.49,25.4 | 110.22,35.29 110.22,25.67 | C10.2 46.99,15.24 48.9,17.14 | 100.38,35.56 100.33,35.56 99.69,36.2 C1.2 95.89,36.2 93.98,34.29 R2.1 | PB2(D7).4 3.91,15.82 2.79,16.94 2.79,37.15 3.7,38.05 PB1(D4).4 | R30.2 62.55,86.68 62.55,75.25 61.59,74.3 C20.2 | IC2.4 43.18,92.71 41.91,91.44 41.91,83.19 C2.2 C5.- 40.64,76.2 39.37,74.93 v30.48,74.93 29.21,76.2 D6.A 29.21,79.06 27.62,77.47 22.86,77.47 21.59,78.74 21.59,82.55 22.86,83.82 C19.2 23.81,88.9 | P-ON.K 68.58,72.39 67.31,71.12 | 110.22,25.4 110.49,25.4 | 31.75,16.51 18.21,16.51 17.53,15.82 PB2(D7).3 15.14,15.82 13.97,16.99 13.97,23.18 15.24,24.45 39.05,24.45 40.64,22.86 C7.2 42.55,22.23 47.62,22.23 52.7,27.3 64.14,27.3 C8.2 64.77,27.94 66.04,29.21 86.27,29.21 90.08,25.4 110.22,25.4
  Bottom 1.016: 23.81,88.9 THERMO.K 19.05,88.9 19.05,107.63 18.1,108.58 15.24,108.58 | 110.22,25.4 110.22,25.67 | 88.27,123.83 99.69,123.83 | 99.69,123.83 104.14,123.83 110.49,117.47 AIN(7).SLEEVE AIN(6).SLEEVE AIN(5).SLEEVE AIN(4).SLEEVE PWM(D5).SLEEVE 100.38,35.56 | C22.1 88.27,123.83 | C16.1 D4.A 85.09,77.15 85.41,77.47 | 85.41,77.47 87,79.06 99.06,79.06 99.69,78.42 99.69,73.98 99.06,73.34 93.43,73.34 87.95,67.86 C15.1 88.04,61.59 85.09,58.65 D2.A | 110.49,25.4 110.22,25.67 | 23.81,88.9 23.81,91.12 26.99,94.3 26.99,112.08 28.57,113.67 U$2.4 | 100.38,35.56 100.38,29.93 99.23,28.78 92.51,28.78 87.63,33.66 78.11,33.66 77.47,34.29 C18.2 | 15.24,108.58 C6.2 X3.1 | 16.51,113.67 C9.2 16.19,114.62 16.83,115.25 X2.1 16.83,110.17 15.24,108.58 | v30.48,68.58 BUZZER(D3).- 40.64,66.04 ARDUINO_NANO2.19 | 86.36,99.06 C17.1 87,100.97 | 86.36,100.33 87,100.97
LED-B/SCK-6  (via drill 0.64 pad 1.78)
  Top 0.813: v31.75,100.33 v24.45,100.33
  Bottom 0.813: v24.45,100.33 22.86,100.33 21.91,101.28 X2.3 21.91,122.56 20.95,123.51 12.38,123.51 3.49,114.62 3.49,104.46 4.45,103.5 X3.3 | v31.75,100.33 31.88,100.2 52.93,100.2 54.86,98.27 54.86,82.8 52.07,80.01 52.07,54.29 51.12,53.34 ARDUINO_NANO2.24 R10.2
LED-G/CS-1-10  (via drill 0.64 pad 1.78)
  Top 0.813: v31.75,103.5 v24.45,103.5
  Bottom 0.813: v31.75,103.5 54.51,103.5 56.01,102.01 56.01,77.79 55.24,77.03 55.24,42.55 53.98,41.27 52.39,41.27 50.48,43.18 ARDUINO_NANO2.28 47.62,43.18 46.35,44.45 R8.2 | X2.4 v24.45,103.5
LED-R/SO-11  (via drill 0.64 pad 1.78)  (1 unrouted)
  Top 0.813: v38.73,39.05 v45.72,39.05
  Bottom 0.813: v38.73,39.05 38.73,32.7 35.12,29.08 11.24,29.08 10.16,30.16 10.16,40.01 3.17,46.99 3.17,52.7 5.97,55.5 5.97,59.12 1.75,63.34 1.75,99.22 | v45.72,39.05 R7.2 46.99,40.64 ARDUINO_NANO2.29 | X3.5 7.94,98.11 3.17,98.11 1.75,99.54 1.75,116.05 10.63,124.93 25.88,124.93 26.99,123.83 X2.5
N$1
  Bottom 0.813: X1.2 101.6,13.99 95.22,7.62 R15.2 87.63,7.62 86.36,8.89 86.36,10.79 87.63,12.06 89.53,12.06 90.81,13.34 90.81,22.23 85.72,27.3 75.25,27.3 | 75.25,27.3 Q1.1 73.34,27.3 | IC1.2 58.42,17.14 59.37,16.19 66.36,16.19 68.58,18.41 68.58,26.67 69.22,27.3 73.34,27.3 | 73.34,27.3 75.25,27.3
N$2
  Bottom 0.813: RGB.RED 34.29,36.37 35.56,37.64 R7.1
N$3
  Bottom 0.813: R8.1 34.56,44.45 33.63,43.52 33.63,40.98 33.02,40.37 RGB.BLU
N$4
  Bottom 0.813: R10.1 31.75,53.34 31.11,52.7 RGB.GRN
N$5
  Bottom 0.813: R24.2 62.23,20.32 IC1.1
N$6
  Bottom 0.813: C8.1 64.77,23.5 63.5,22.23 56.52,22.23 55.88,21.59 | 55.88,21.59 55.88,24.13 55.24,24.77 R13.1 | 55.88,21.59 IC1.3
N$7
  Bottom 0.813: IC2.3 50.16,90.17 51.44,91.44 R4.2 R30.1 50.8,87.63 48.9,85.72 48.9,80.64 47.62,79.38 R29.1
N$8  (via drill 2.79 pad 3.81)
  other vias: 111.12,123.83
N$9
  Bottom 0.813: C3.+ 27.94,8.89 U2.2
N$10
  Bottom 0.813: U2.4 33.02,8.89 C3.-
N$11
  Bottom 0.813: C7.1 45.72,25.4 R13.2 46.35,25.4 47.94,25.4 53.34,30.8 R12.1
N$12
  Bottom 0.813: X1.1 102.26,19.02 R3.2 | R3.2 94.61,23.5 R2.2 | R16.2 93.98,10.16 95.25,11.43 95.25,22.86 95.89,23.5 R3.2
N$13
  Bottom 0.813: P-ON.A 72.39,73.66 R1.1
N$14
  Bottom 0.813: R24.1 Q1.2
N$15
  Bottom 0.813: R31.S R31.E 19.68,70.48 21.59,72.39 41.91,72.39 43.81,74.3 43.81,83.19 IC2.1 IC2.2
N$16
  Bottom 0.813: R9.1 98.5,49.61 AIN(4).RING
N$17
  Bottom 0.813: R15.1 R17.2 79.06,2.86 55.56,2.86 53.34,5.08 IC1.5
N$18
  Bottom 0.813: R19.A 82.55,18.41 83.82,17.14 83.82,11.43 82.55,10.16 R16.1 80.01,10.16 74.61,4.76 56.83,4.76 55.88,5.71 IC1.6
N$19  (via drill 2.79 pad 3.81)
  other vias: 3.17,123.83
N$20
  Bottom 0.813: R19.S R19.E 87.63,15.24 R20.2
N$21
  Bottom 0.813: IC1.7 R18.2 58.86,7.11 73.79,7.11 80.64,13.97 R20.1
N$22
  Bottom 0.813: R11.1 98.11,68.26 98.5,68.66
  Bottom 1.016: 98.5,68.66 AIN(5).RING
N$24  (via drill 2.79 pad 3.81)
  other vias: 3.17,3.17
N$25
  Bottom 0.813: L1.1 19.09,74.97 16.51,72.39 16.51,53.98 17.14,53.34 R31.A
N$26  (via drill 2.79 pad 3.81)
  other vias: 111.12,3.17
N$27
  Bottom 0.813: THERMO.A 24.13,93.98 R22.2
N$29
  Bottom 0.813: R14.1 99.61,87.71 AIN(6).RING
N$31
  Bottom 0.813: 102.23,106.68 100.33,108.58 R21.1 | 102.31,106.76 102.23,106.68 | 102.23,106.68 105.41,106.68 AIN(7).RING
PB1  (1 unrouted)
  Bottom 0.813: R6.1 13.97,41.27 13.97,34.29 15.19,33.07 PB1(D4).1 24.5,33.07 27.3,35.88 27.3,57.78 27.94,58.42 ARDUINO_NANO2.22
PB2  (1 unrouted)
  Bottom 0.813: PB2(D7).2 8.89,10.85 10.11,12.06 10.11,20.37 R5.1 8.89,26.67 9.84,27.62 37.47,27.62 38.89,29.05 47.47,29.05 48.26,29.84 48.26,33.34 46.67,34.92 43.81,34.92 42.55,36.2 42.55,50.16 43.18,50.8 ARDUINO_NANO2.25
PWM-CT
  Bottom 0.813: R12.2 53.34,44.45 52.07,45.72 ARDUINO_NANO2.27
RC-A0
  Bottom 0.813: 62.55,33.02 63.5,33.02 | 63.5,33.02 68.58,33.02 C18.1 | 62.55,33.02 62.55,33.97 | R28.1 62.55,33.02 | 63.5,33.02 62.55,33.97 | 62.55,33.97 61.91,34.61 61.91,44.13 63.5,45.72 ARDUINO_NANO2.4
RC-INP
  Bottom 0.813: R28.2 58.42,36.83 57.83,36.24 45.04,36.24 43.81,37.47 43.81,47.62 44.45,48.26 ARDUINO_NANO2.26 52.39,48.26 53.66,49.53 53.66,79.06 R29.2
RLC-A2
  Bottom 0.813: L1.2 24.17,80.01 25.72,80.01 26.35,80.64 C19.1 27.62,85.09 | D5.A 33.02,83.82 31.75,85.09 27.62,85.09 | 27.62,85.09 29.21,86.68 D6.C 29.21,105.09 30.8,106.68 54.93,106.68 57.15,104.46 57.15,51.75 58.1,50.8 ARDUINO_NANO2.6
TRIG  (via drill 0.64 pad 1.78)
  Top 0.813: v75.88,70.8 v75.88,55.24
  Bottom 0.813: v75.88,55.24 75.88,39.05 74.93,38.1 ARDUINO_NANO2.1 | U$2.2 58.42,120.65 59.34,121.57 76.55,121.57 79.38,118.75 79.38,90.17 74.3,85.09 74.3,78.11 75.88,76.52 v75.88,70.8
VOLTAGE-A1
  Bottom 0.813: R18.1 47.94,6.67 C10.1 45.09,5.71 13.34,5.71 12.06,6.99 12.06,25.4 12.7,26.04 38.1,26.04 39.37,27.3 47.62,27.3 49.53,29.21 49.53,33.34 50.8,34.61 60.01,34.61 60.33,34.92 60.33,45.72 62.87,48.26 ARDUINO_NANO2.5

### Text on the board
Bottom: PHYSICS WITH / ARDUINO
tNames: GND | +5V | SCK | CS | SO | GND | +5V | SCK | CS-2 | SO | THERMO | RGB | RLC | DIODE / TRACER